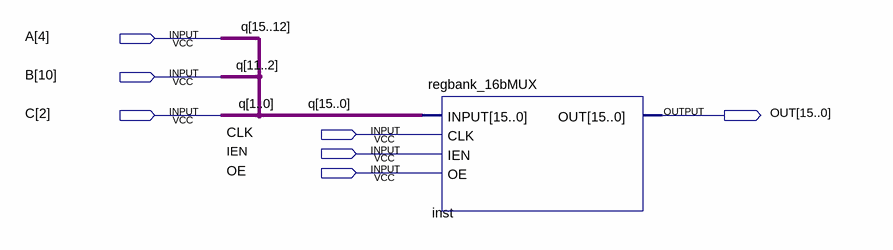
[diagram p0: schematic sheet]
// Quartus schematic TEST_BUS.bdf as structural Verilog: 1 symbols, 7 pins
module TEST_BUS (
  input  [4:4] A,
  input  [10:10] B,
  input  [2:2] C,
  input  CLK,
  input  IEN,
  input  OE,
  output [15:0] OUT
);

  wire [15:0] q;

  regbank_16bMUX inst (.INPUT(q), .CLK(CLK), .IEN(IEN), .OE(OE), .OUT(OUT));
endmodule
